# EAGLE schematic Face2 (EAGLE 6.1)
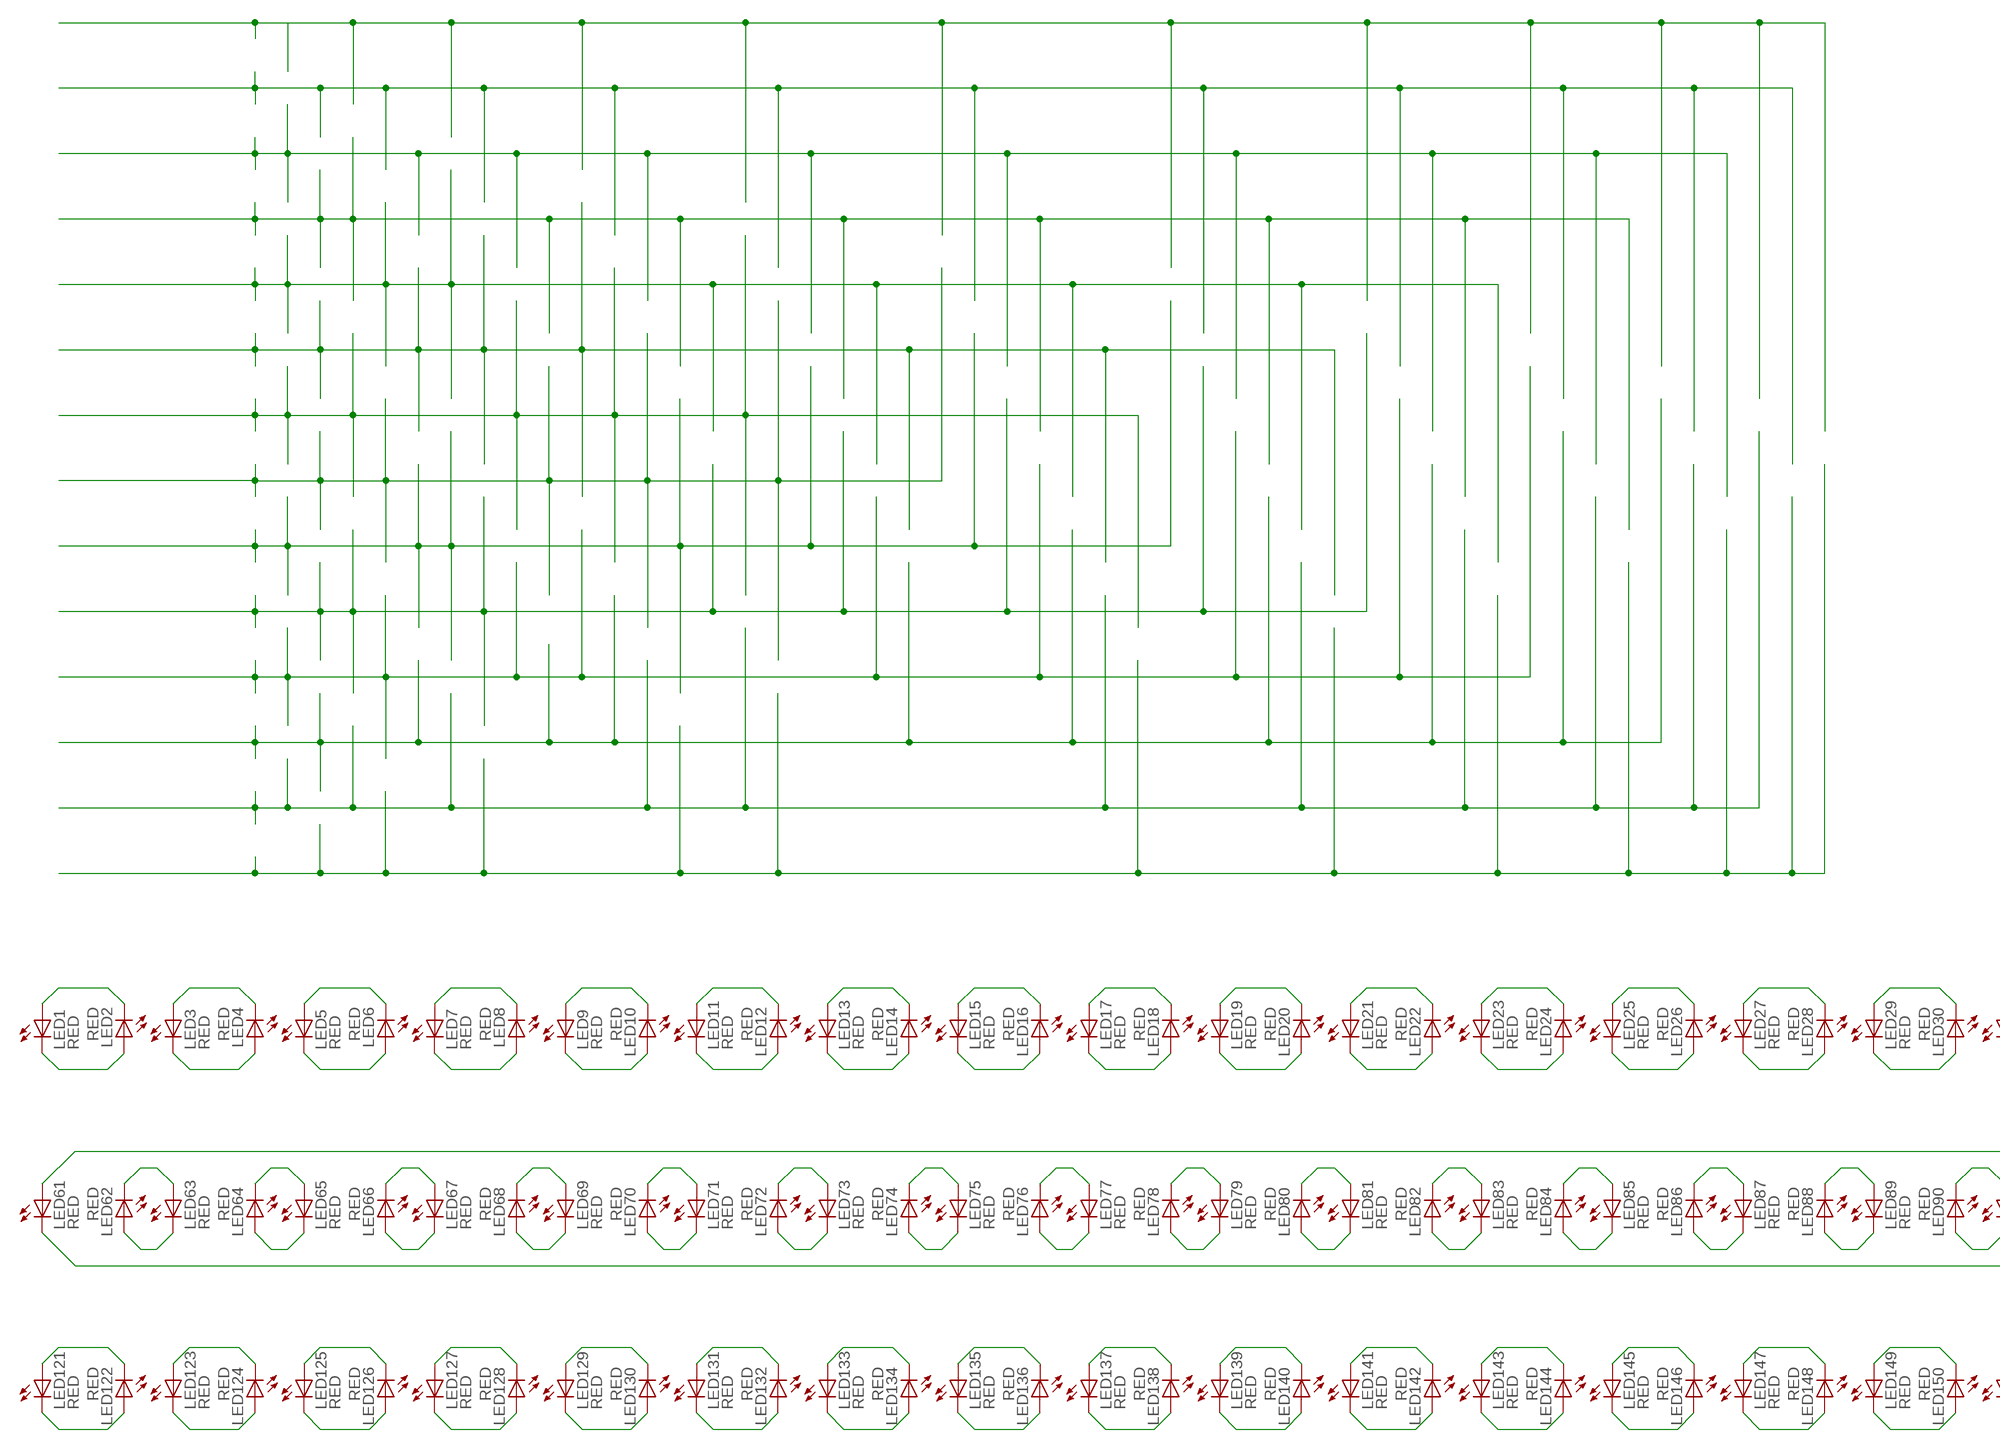
[diagram p0: schematic, sheet 1, part 1 of 2]
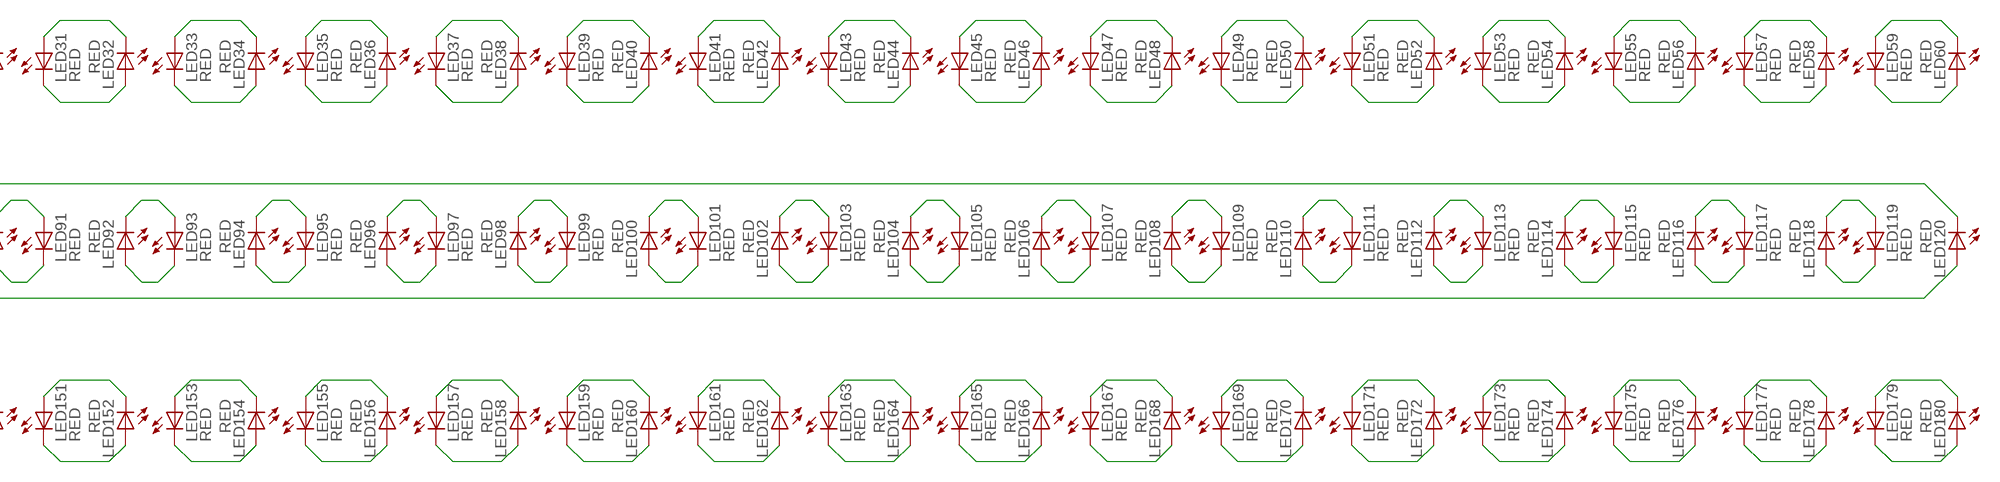
[diagram p1: schematic, sheet 1, part 2 of 2]

## Parts
LED1  RED  LED0603  [LED-0603]
LED2  RED  LED0603  [LED-0603]
LED3  RED  LED0603  [LED-0603]
LED4  RED  LED0603  [LED-0603]
LED5  RED  LED0603  [LED-0603]
LED6  RED  LED0603  [LED-0603]
LED7  RED  LED0603  [LED-0603]
LED8  RED  LED0603  [LED-0603]
LED9  RED  LED0603  [LED-0603]
LED10  RED  LED0603  [LED-0603]
LED11  RED  LED0603  [LED-0603]
LED12  RED  LED0603  [LED-0603]
LED13  RED  LED0603  [LED-0603]
LED14  RED  LED0603  [LED-0603]
LED15  RED  LED0603  [LED-0603]
LED16  RED  LED0603  [LED-0603]
LED17  RED  LED0603  [LED-0603]
LED18  RED  LED0603  [LED-0603]
LED19  RED  LED0603  [LED-0603]
LED20  RED  LED0603  [LED-0603]
LED21  RED  LED0603  [LED-0603]
LED22  RED  LED0603  [LED-0603]
LED23  RED  LED0603  [LED-0603]
LED24  RED  LED0603  [LED-0603]
LED25  RED  LED0603  [LED-0603]
LED26  RED  LED0603  [LED-0603]
LED27  RED  LED0603  [LED-0603]
LED28  RED  LED0603  [LED-0603]
LED29  RED  LED0603  [LED-0603]
LED30  RED  LED0603  [LED-0603]
LED31  RED  LED0603  [LED-0603]
LED32  RED  LED0603  [LED-0603]
LED33  RED  LED0603  [LED-0603]
LED34  RED  LED0603  [LED-0603]
LED35  RED  LED0603  [LED-0603]
LED36  RED  LED0603  [LED-0603]
LED37  RED  LED0603  [LED-0603]
LED38  RED  LED0603  [LED-0603]
LED39  RED  LED0603  [LED-0603]
LED40  RED  LED0603  [LED-0603]
LED41  RED  LED0603  [LED-0603]
LED42  RED  LED0603  [LED-0603]
LED43  RED  LED0603  [LED-0603]
LED44  RED  LED0603  [LED-0603]
LED45  RED  LED0603  [LED-0603]
LED46  RED  LED0603  [LED-0603]
LED47  RED  LED0603  [LED-0603]
LED48  RED  LED0603  [LED-0603]
LED49  RED  LED0603  [LED-0603]
LED50  RED  LED0603  [LED-0603]
LED51  RED  LED0603  [LED-0603]
LED52  RED  LED0603  [LED-0603]
LED53  RED  LED0603  [LED-0603]
LED54  RED  LED0603  [LED-0603]
LED55  RED  LED0603  [LED-0603]
LED56  RED  LED0603  [LED-0603]
LED57  RED  LED0603  [LED-0603]
LED58  RED  LED0603  [LED-0603]
LED59  RED  LED0603  [LED-0603]
LED60  RED  LED0603  [LED-0603]
LED61  RED  LED0603  [LED-0603]
LED62  RED  LED0603  [LED-0603]
LED63  RED  LED0603  [LED-0603]
LED64  RED  LED0603  [LED-0603]
LED65  RED  LED0603  [LED-0603]
LED66  RED  LED0603  [LED-0603]
LED67  RED  LED0603  [LED-0603]
LED68  RED  LED0603  [LED-0603]
LED69  RED  LED0603  [LED-0603]
LED70  RED  LED0603  [LED-0603]
LED71  RED  LED0603  [LED-0603]
LED72  RED  LED0603  [LED-0603]
LED73  RED  LED0603  [LED-0603]
LED74  RED  LED0603  [LED-0603]
LED75  RED  LED0603  [LED-0603]
LED76  RED  LED0603  [LED-0603]
LED77  RED  LED0603  [LED-0603]
LED78  RED  LED0603  [LED-0603]
LED79  RED  LED0603  [LED-0603]
LED80  RED  LED0603  [LED-0603]
LED81  RED  LED0603  [LED-0603]
LED82  RED  LED0603  [LED-0603]
LED83  RED  LED0603  [LED-0603]
LED84  RED  LED0603  [LED-0603]
LED85  RED  LED0603  [LED-0603]
LED86  RED  LED0603  [LED-0603]
LED87  RED  LED0603  [LED-0603]
LED88  RED  LED0603  [LED-0603]
LED89  RED  LED0603  [LED-0603]
LED90  RED  LED0603  [LED-0603]
LED91  RED  LED0603  [LED-0603]
LED92  RED  LED0603  [LED-0603]
LED93  RED  LED0603  [LED-0603]
LED94  RED  LED0603  [LED-0603]
LED95  RED  LED0603  [LED-0603]
LED96  RED  LED0603  [LED-0603]
LED97  RED  LED0603  [LED-0603]
LED98  RED  LED0603  [LED-0603]
LED99  RED  LED0603  [LED-0603]
LED100  RED  LED0603  [LED-0603]
LED101  RED  LED0603  [LED-0603]
LED102  RED  LED0603  [LED-0603]
LED103  RED  LED0603  [LED-0603]
LED104  RED  LED0603  [LED-0603]
LED105  RED  LED0603  [LED-0603]
LED106  RED  LED0603  [LED-0603]
LED107  RED  LED0603  [LED-0603]
LED108  RED  LED0603  [LED-0603]
LED109  RED  LED0603  [LED-0603]
LED110  RED  LED0603  [LED-0603]
LED111  RED  LED0603  [LED-0603]
LED112  RED  LED0603  [LED-0603]
LED113  RED  LED0603  [LED-0603]
LED114  RED  LED0603  [LED-0603]
LED115  RED  LED0603  [LED-0603]
LED116  RED  LED0603  [LED-0603]
LED117  RED  LED0603  [LED-0603]
LED118  RED  LED0603  [LED-0603]
LED119  RED  LED0603  [LED-0603]
LED120  RED  LED0603  [LED-0603]
LED121  RED  LED0603  [LED-0603]
LED122  RED  LED0603  [LED-0603]
LED123  RED  LED0603  [LED-0603]
LED124  RED  LED0603  [LED-0603]
LED125  RED  LED0603  [LED-0603]
LED126  RED  LED0603  [LED-0603]
LED127  RED  LED0603  [LED-0603]
LED128  RED  LED0603  [LED-0603]
LED129  RED  LED0603  [LED-0603]
LED130  RED  LED0603  [LED-0603]
LED131  RED  LED0603  [LED-0603]
LED132  RED  LED0603  [LED-0603]
LED133  RED  LED0603  [LED-0603]
LED134  RED  LED0603  [LED-0603]
LED135  RED  LED0603  [LED-0603]
LED136  RED  LED0603  [LED-0603]
LED137  RED  LED0603  [LED-0603]
LED138  RED  LED0603  [LED-0603]
LED139  RED  LED0603  [LED-0603]
LED140  RED  LED0603  [LED-0603]
LED141  RED  LED0603  [LED-0603]
LED142  RED  LED0603  [LED-0603]
LED143  RED  LED0603  [LED-0603]
LED144  RED  LED0603  [LED-0603]
LED145  RED  LED0603  [LED-0603]
LED146  RED  LED0603  [LED-0603]
LED147  RED  LED0603  [LED-0603]
LED148  RED  LED0603  [LED-0603]
LED149  RED  LED0603  [LED-0603]
LED150  RED  LED0603  [LED-0603]
LED151  RED  LED0603  [LED-0603]
LED152  RED  LED0603  [LED-0603]
LED153  RED  LED0603  [LED-0603]
LED154  RED  LED0603  [LED-0603]
LED155  RED  LED0603  [LED-0603]
LED156  RED  LED0603  [LED-0603]
LED157  RED  LED0603  [LED-0603]
LED158  RED  LED0603  [LED-0603]
LED159  RED  LED0603  [LED-0603]
LED160  RED  LED0603  [LED-0603]
LED161  RED  LED0603  [LED-0603]
LED162  RED  LED0603  [LED-0603]
LED163  RED  LED0603  [LED-0603]
LED164  RED  LED0603  [LED-0603]
LED165  RED  LED0603  [LED-0603]
LED166  RED  LED0603  [LED-0603]
LED167  RED  LED0603  [LED-0603]
LED168  RED  LED0603  [LED-0603]
LED169  RED  LED0603  [LED-0603]
LED170  RED  LED0603  [LED-0603]
LED171  RED  LED0603  [LED-0603]
LED172  RED  LED0603  [LED-0603]
LED173  RED  LED0603  [LED-0603]
LED174  RED  LED0603  [LED-0603]
LED175  RED  LED0603  [LED-0603]
LED176  RED  LED0603  [LED-0603]
LED177  RED  LED0603  [LED-0603]
LED178  RED  LED0603  [LED-0603]
LED179  RED  LED0603  [LED-0603]
LED180  RED  LED0603  [LED-0603]

## Nets
N$1: LED5.C LED6.A
N$2: LED5.A LED6.C
N$3: LED3.C LED4.A
N$4: LED7.A LED8.C
N$5: LED9.A LED10.C
N$6: LED11.A LED12.C
N$7: LED13.A LED14.C
N$8: LED15.A LED16.C
N$9: LED17.A LED18.C
N$10: LED19.A LED20.C
N$11: LED21.A LED22.C
N$12: LED23.A LED24.C
N$13: LED25.A LED26.C
N$14: LED27.A LED28.C
N$15: LED29.A LED30.C
N$16: LED31.A LED32.C
N$17: LED33.A LED34.C
N$18: LED35.A LED36.C
N$19: LED37.A LED38.C
N$20: LED39.A LED40.C
N$21: LED41.A LED42.C
N$22: LED43.A LED44.C
N$23: LED45.A LED46.C
N$24: LED47.A LED48.C
N$25: LED49.A LED50.C
N$26: LED51.A LED52.C
N$27: LED53.A LED54.C
N$28: LED55.A LED56.C
N$29: LED57.A LED58.C
N$30: LED59.A LED60.C
N$31: LED62.C LED63.A
N$32: LED64.C LED65.A
N$33: LED66.C LED67.A
N$34: LED68.C LED69.A
N$35: LED70.C LED71.A
N$36: LED72.C LED73.A
N$37: LED74.C LED75.A
N$38: LED76.C LED77.A
N$39: LED78.C LED79.A
N$40: LED80.C LED81.A
N$41: LED82.C LED83.A
N$42: LED84.C LED85.A
N$43: LED86.C LED87.A
N$44: LED88.C LED89.A
N$45: LED90.C LED91.A
N$46: LED92.C LED93.A
N$47: LED94.C LED95.A
N$48: LED96.C LED97.A
N$49: LED98.C LED99.A
N$50: LED100.C LED101.A
N$51: LED102.C LED103.A
N$52: LED104.C LED105.A
N$53: LED106.C LED107.A
N$54: LED108.C LED109.A
N$55: LED110.C LED111.A
N$56: LED112.C LED113.A
N$57: LED114.C LED115.A
N$58: LED116.C LED117.A
N$59: LED118.C LED119.A
N$60: LED61.A LED120.C
N$61: LED121.A LED122.C
N$62: LED123.A LED124.C
N$63: LED125.A LED126.C
N$64: LED127.A LED128.C
N$65: LED129.A LED130.C
N$66: LED131.A LED132.C
N$67: LED133.A LED134.C
N$68: LED135.A LED136.C
N$69: LED137.A LED138.C
N$70: LED139.A LED140.C
N$71: LED141.A LED142.C
N$72: LED143.A LED144.C
N$73: LED145.A LED146.C
N$74: LED147.A LED148.C
N$75: LED149.A LED150.C
N$76: LED151.A LED152.C
N$77: LED153.A LED154.C
N$78: LED155.A LED156.C
N$79: LED157.A LED158.C
N$80: LED159.A LED160.C
N$81: LED161.A LED162.C
N$82: LED163.A LED164.C
N$83: LED165.A LED166.C
N$84: LED167.A LED168.C
N$85: LED169.A LED170.C
N$86: LED171.A LED172.C
N$87: LED173.A LED174.C
N$88: LED175.A LED176.C
N$89: LED177.A LED178.C
N$90: LED179.A LED180.C
N$91: LED3.A LED4.C
N$92: LED1.C LED2.A
N$93: LED1.A LED2.C
N$94: LED7.C LED8.A
N$95: LED9.C LED10.A
N$96: LED11.C LED12.A
N$97: LED13.C LED14.A
N$98: LED15.C LED16.A
N$99: LED17.C LED18.A
N$100: LED19.C LED20.A
N$101: LED21.C LED22.A
N$102: LED23.C LED24.A
N$103: LED25.C LED26.A
N$104: LED27.C LED28.A
N$105: LED29.C LED30.A
N$106: LED31.C LED32.A
N$107: LED33.C LED34.A
N$108: LED35.C LED36.A
N$109: LED37.C LED38.A
N$110: LED39.C LED40.A
N$111: LED41.C LED42.A
N$112: LED43.C LED44.A
N$113: LED45.C LED46.A
N$114: LED47.C LED48.A
N$115: LED49.C LED50.A
N$116: LED51.C LED52.A
N$117: LED53.C LED54.A
N$118: LED55.C LED56.A
N$119: LED57.C LED58.A
N$120: LED59.C LED60.A
N$121: LED62.A LED63.C
N$122: LED64.A LED65.C
N$123: LED66.A LED67.C
N$124: LED68.A LED69.C
N$125: LED70.A LED71.C
N$126: LED72.A LED73.C
N$127: LED74.A LED75.C
N$128: LED76.A LED77.C
N$129: LED78.A LED79.C
N$130: LED80.A LED81.C
N$131: LED82.A LED83.C
N$132: LED84.A LED85.C
N$133: LED86.A LED87.C
N$134: LED88.A LED89.C
N$135: LED90.A LED91.C
N$136: LED92.A LED93.C
N$137: LED94.A LED95.C
N$138: LED96.A LED97.C
N$139: LED98.A LED99.C
N$140: LED100.A LED101.C
N$141: LED102.A LED103.C
N$142: LED104.A LED105.C
N$143: LED106.A LED107.C
N$144: LED108.A LED109.C
N$145: LED110.A LED111.C
N$146: LED112.A LED113.C
N$147: LED114.A LED115.C
N$148: LED116.A LED117.C
N$149: LED118.A LED119.C
N$150: LED61.C LED120.A
N$151: LED121.C LED122.A
N$152: LED123.C LED124.A
N$153: LED125.C LED126.A
N$154: LED127.C LED128.A
N$155: LED129.C LED130.A
N$156: LED131.C LED132.A
N$157: LED133.C LED134.A
N$158: LED135.C LED136.A
N$159: LED137.C LED138.A
N$160: LED139.C LED140.A
N$161: LED141.C LED142.A
N$162: LED143.C LED144.A
N$163: LED145.C LED146.A
N$164: LED147.C LED148.A
N$165: LED149.C LED150.A
N$166: LED151.C LED152.A
N$167: LED153.C LED154.A
N$168: LED155.C LED156.A
N$169: LED157.C LED158.A
N$170: LED159.C LED160.A
N$171: LED161.C LED162.A
N$172: LED163.C LED164.A
N$173: LED165.C LED166.A
N$174: LED167.C LED168.A
N$175: LED169.C LED170.A
N$176: LED171.C LED172.A
N$177: LED173.C LED174.A
N$178: LED175.C LED176.A
N$179: LED177.C LED178.A
N$180: LED179.C LED180.A

## Library data of the parts
LED1-LED180 = SparkFun-LED:LED: LEDs Standard schematic elements and footprints for 5mm, 3mm, 1206, and 0603 sized LEDs. 5mm - Spark Fun Electronics SKU : COM-00529 (and others)